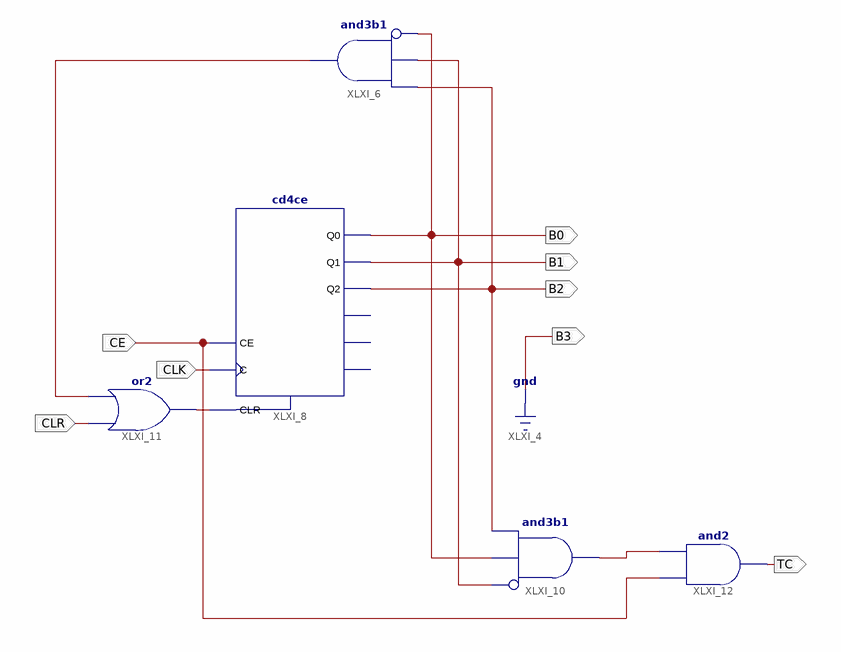
[diagram p0: schematic sheet 1]
// Xilinx ISE schematic Count6.sch (spartan6) as structural Verilog: 5 symbols, 8 ports
module Count6 (
  input  CE,
  input  CLK,
  input  CLR,
  output B2,
  output B3,
  output B0,
  output B1,
  output TC
);

  wire XLXN_12, XLXN_13, XLXN_20;

  cd4ce XLXI_8 (.C(CLK), .CE(CE), .CLR(XLXN_12), .Q0(B0), .Q1(B1), .Q2(B2));  // open: CEO, Q3, TC
  and XLXI_6 (XLXN_13, ~B0, B1, B2);  // and3b1
  and XLXI_10 (XLXN_20, ~B1, B0, B2);  // and3b1
  or XLXI_11 (XLXN_12, CLR, XLXN_13);
  and XLXI_12 (TC, CE, XLXN_20);

  assign B3 = 1'b0;
endmodule
